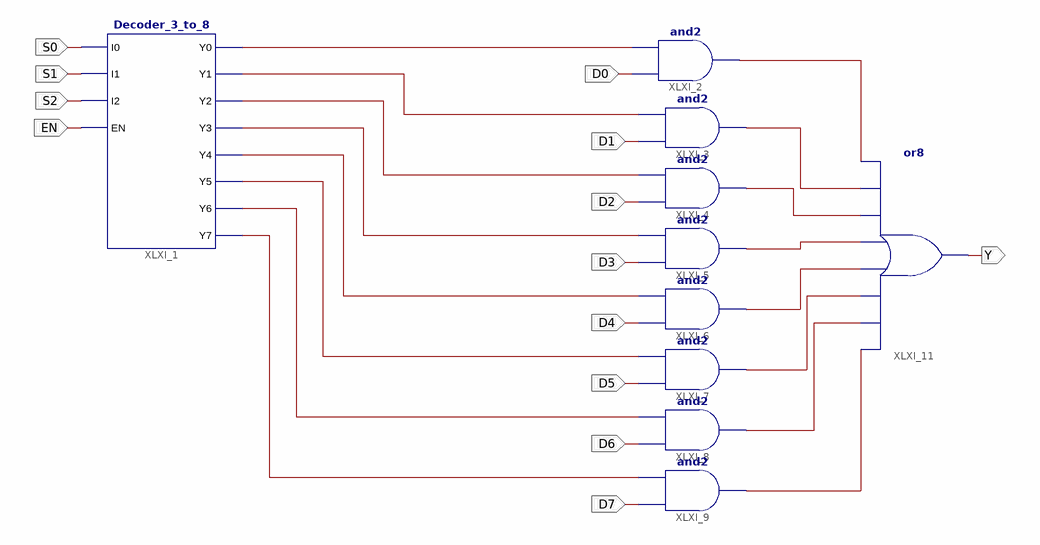
[diagram p0: schematic sheet 1]
// Xilinx ISE schematic MUX_8_to_1.sch (spartan3e) as structural Verilog: 10 symbols, 13 ports
module MUX_8_to_1 (
  input  D0,
  input  D1,
  input  D2,
  input  D3,
  input  D4,
  input  D5,
  input  D6,
  input  D7,
  input  EN,
  input  S2,
  input  S1,
  input  S0,
  output Y
);

  wire XLXN_2, XLXN_6, XLXN_7, XLXN_8, XLXN_9, XLXN_10, XLXN_11, XLXN_12, XLXN_23, XLXN_24, XLXN_25, XLXN_26,
       XLXN_27, XLXN_28, XLXN_29, XLXN_30;

  Decoder_3_to_8 XLXI_1 (
    .EN(EN), .I0(S0), .I1(S1), .I2(S2), .Y0(XLXN_2), .Y1(XLXN_12), .Y2(XLXN_11), .Y3(XLXN_10), .Y4(XLXN_9),
    .Y5(XLXN_8), .Y6(XLXN_7), .Y7(XLXN_6));
  and XLXI_2 (XLXN_23, D0, XLXN_2);
  and XLXI_3 (XLXN_24, D1, XLXN_12);
  and XLXI_4 (XLXN_25, D2, XLXN_11);
  and XLXI_5 (XLXN_26, D3, XLXN_10);
  and XLXI_6 (XLXN_27, D4, XLXN_9);
  and XLXI_7 (XLXN_28, D5, XLXN_8);
  and XLXI_8 (XLXN_29, D6, XLXN_7);
  and XLXI_9 (XLXN_30, D7, XLXN_6);
  or XLXI_11 (Y, XLXN_30, XLXN_29, XLXN_28, XLXN_27, XLXN_26, XLXN_25, XLXN_24, XLXN_23);
endmodule
